# EasyEDA schematic 2020 Light sensor -  Schematic.json
TITLE: 2020 Light Sensor; REV: 1.0; Date: 2019-08-27; Sheet: 1/1; Drawn By: naichen; Company: Your Company
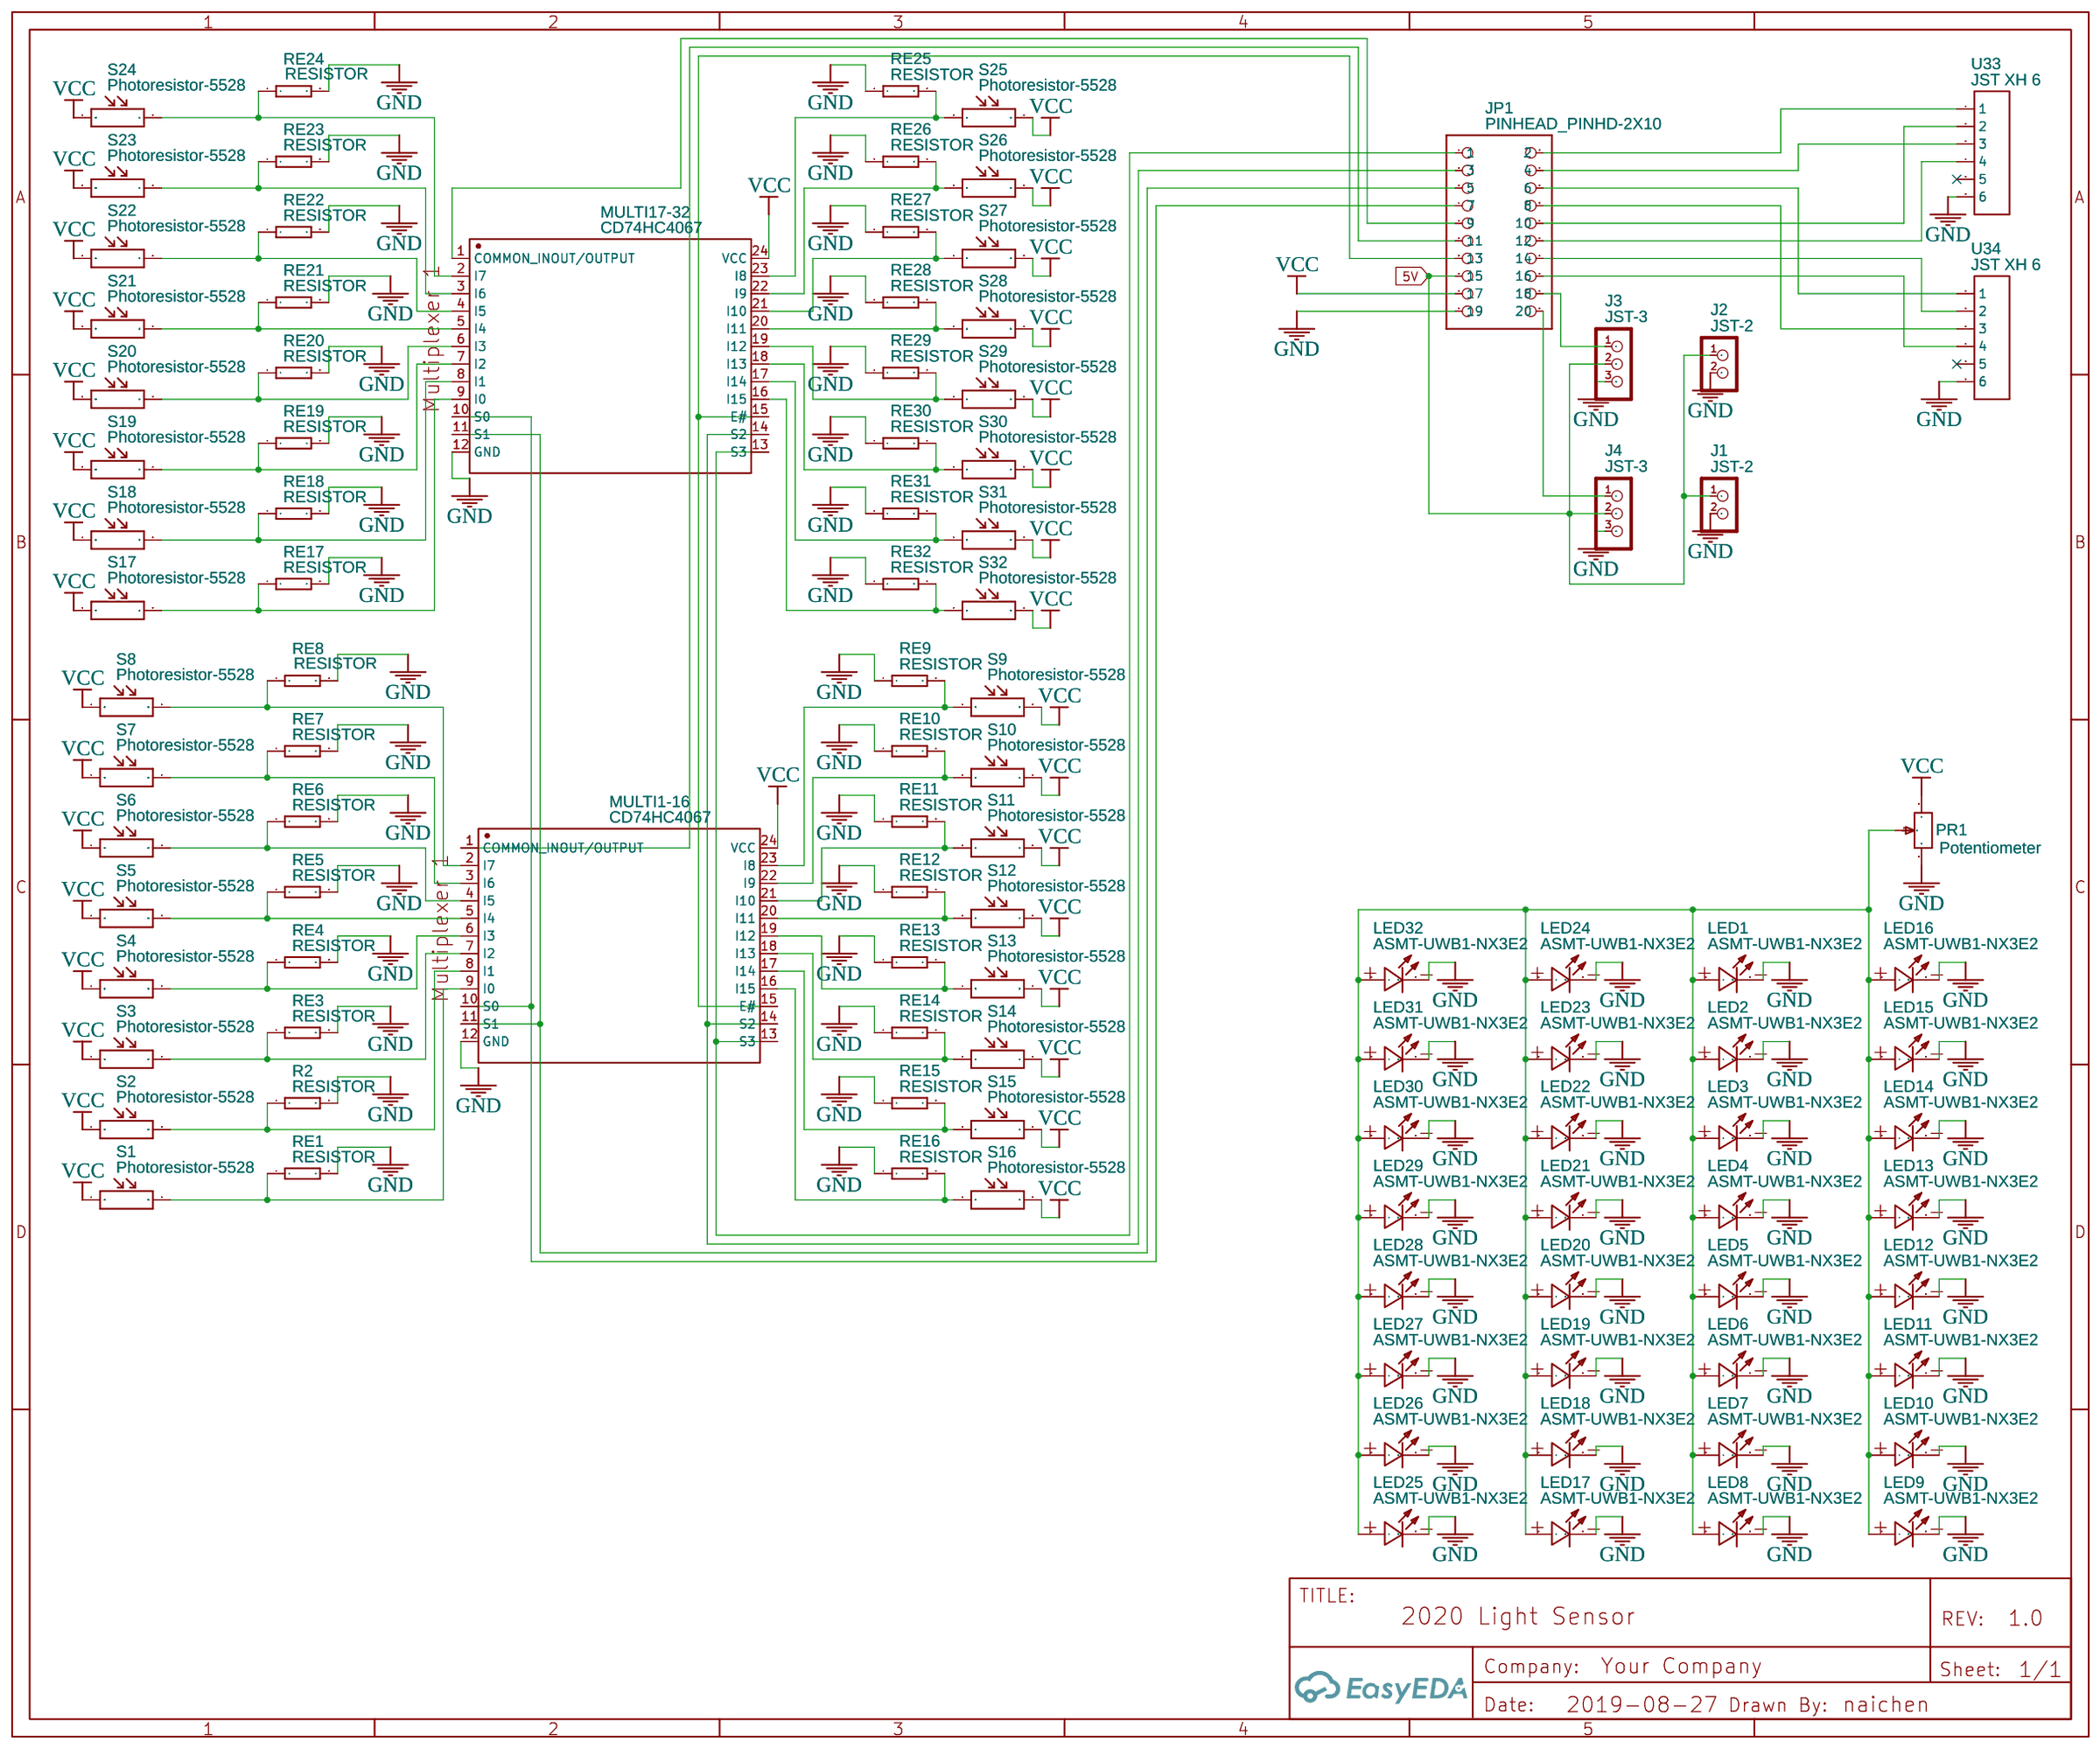
[diagram p0: schematic sheet]

## Parts
J1  JST-2  [JST-2]
J2  JST-2  [JST-2]
J3  JST-3  [JST-3]
J4  JST-3  [JST-3]
JP1  PINHEAD_PINHD-2X10  [PINHEAD_2X10]
LED1  ASMT-UWB1-NX3E2  [ASMT-PAD]
LED2  ASMT-UWB1-NX3E2  [ASMT-PAD]
LED3  ASMT-UWB1-NX3E2  [ASMT-PAD]
LED4  ASMT-UWB1-NX3E2  [ASMT-PAD]
LED5  ASMT-UWB1-NX3E2  [ASMT-PAD]
LED6  ASMT-UWB1-NX3E2  [ASMT-PAD]
LED7  ASMT-UWB1-NX3E2  [ASMT-PAD]
LED8  ASMT-UWB1-NX3E2  [ASMT-PAD]
LED9  ASMT-UWB1-NX3E2  [ASMT-PAD]
LED10  ASMT-UWB1-NX3E2  [ASMT-PAD]
LED11  ASMT-UWB1-NX3E2  [ASMT-PAD]
LED12  ASMT-UWB1-NX3E2  [ASMT-PAD]
LED13  ASMT-UWB1-NX3E2  [ASMT-PAD]
LED14  ASMT-UWB1-NX3E2  [ASMT-PAD]
LED15  ASMT-UWB1-NX3E2  [ASMT-PAD]
LED16  ASMT-UWB1-NX3E2  [ASMT-PAD]
LED17  ASMT-UWB1-NX3E2  [ASMT-PAD]
LED18  ASMT-UWB1-NX3E2  [ASMT-PAD]
LED19  ASMT-UWB1-NX3E2  [ASMT-PAD]
LED20  ASMT-UWB1-NX3E2  [ASMT-PAD]
LED21  ASMT-UWB1-NX3E2  [ASMT-PAD]
LED22  ASMT-UWB1-NX3E2  [ASMT-PAD]
LED23  ASMT-UWB1-NX3E2  [ASMT-PAD]
LED24  ASMT-UWB1-NX3E2  [ASMT-PAD]
LED25  ASMT-UWB1-NX3E2  [ASMT-PAD]
LED26  ASMT-UWB1-NX3E2  [ASMT-PAD]
LED27  ASMT-UWB1-NX3E2  [ASMT-PAD]
LED28  ASMT-UWB1-NX3E2  [ASMT-PAD]
LED29  ASMT-UWB1-NX3E2  [ASMT-PAD]
LED30  ASMT-UWB1-NX3E2  [ASMT-PAD]
LED31  ASMT-UWB1-NX3E2  [ASMT-PAD]
LED32  ASMT-UWB1-NX3E2  [ASMT-PAD]
MULTI1-16  CD74HC4067  [SSOP-24_208MIL]
MULTI17-32  CD74HC4067  [SSOP-24_208MIL]
PR1  Potentiometer  [RES-ADJ_3296W]
R2  RESISTOR  [RTH025W]
RE1  RESISTOR  [RTH025W]
RE3  RESISTOR  [RTH025W]
RE4  RESISTOR  [RTH025W]
RE5  RESISTOR  [RTH025W]
RE6  RESISTOR  [RTH025W]
RE7  RESISTOR  [RTH025W]
RE8  RESISTOR  [RTH025W]
RE9  RESISTOR  [RTH025W]
RE10  RESISTOR  [RTH025W]
RE11  RESISTOR  [RTH025W]
RE12  RESISTOR  [RTH025W]
RE13  RESISTOR  [RTH025W]
RE14  RESISTOR  [RTH025W]
RE15  RESISTOR  [RTH025W]
RE16  RESISTOR  [RTH025W]
RE17  RESISTOR  [RTH025W]
RE18  RESISTOR  [RTH025W]
RE19  RESISTOR  [RTH025W]
RE20  RESISTOR  [RTH025W]
RE21  RESISTOR  [RTH025W]
RE22  RESISTOR  [RTH025W]
RE23  RESISTOR  [RTH025W]
RE24  RESISTOR  [RTH025W]
RE25  RESISTOR  [RTH025W]
RE26  RESISTOR  [RTH025W]
RE27  RESISTOR  [RTH025W]
RE28  RESISTOR  [RTH025W]
RE29  RESISTOR  [RTH025W]
RE30  RESISTOR  [RTH025W]
RE31  RESISTOR  [RTH025W]
RE32  RESISTOR  [RTH025W]
S1  Photoresistor-5528  [SNR2-3.0]
S2  Photoresistor-5528  [SNR2-3.0]
S3  Photoresistor-5528  [SNR2-3.0]
S4  Photoresistor-5528  [SNR2-3.0]
S5  Photoresistor-5528  [SNR2-3.0]
S6  Photoresistor-5528  [SNR2-3.0]
S7  Photoresistor-5528  [SNR2-3.0]
S8  Photoresistor-5528  [SNR2-3.0]
S9  Photoresistor-5528  [SNR2-3.0]
S10  Photoresistor-5528  [SNR2-3.0]
S11  Photoresistor-5528  [SNR2-3.0]
S12  Photoresistor-5528  [SNR2-3.0]
S13  Photoresistor-5528  [SNR2-3.0]
S14  Photoresistor-5528  [SNR2-3.0]
S15  Photoresistor-5528  [SNR2-3.0]
S16  Photoresistor-5528  [SNR2-3.0]
S17  Photoresistor-5528  [SNR2-3.0]
S18  Photoresistor-5528  [SNR2-3.0]
S19  Photoresistor-5528  [SNR2-3.0]
S20  Photoresistor-5528  [SNR2-3.0]
S21  Photoresistor-5528  [SNR2-3.0]
S22  Photoresistor-5528  [SNR2-3.0]
S23  Photoresistor-5528  [SNR2-3.0]
S24  Photoresistor-5528  [SNR2-3.0]
S25  Photoresistor-5528  [SNR2-3.0]
S26  Photoresistor-5528  [SNR2-3.0]
S27  Photoresistor-5528  [SNR2-3.0]
S28  Photoresistor-5528  [SNR2-3.0]
S29  Photoresistor-5528  [SNR2-3.0]
S30  Photoresistor-5528  [SNR2-3.0]
S31  Photoresistor-5528  [SNR2-3.0]
S32  Photoresistor-5528  [SNR2-3.0]
U33  JST XH 6  [JST_XH_6X2.54MM]
U34  JST XH 6  [JST_XH_6X2.54MM]

## Library data of the parts
J1 J2 = JST-2: Contributor: cpu76239
J3 J4 = JST-3: Contributor: cpu76239
JP1 = -: Contributor: Airtau
LED1-LED32 = -: Supplier: LCSC; Supplier Part: C188684; Manufacturer: Broadcom; Manufacturer Part: ASMT-BG20-AS000; Contributor: LCSC
MULTI1-16 MULTI17-32 = -: sourceId: 1T5FDZYC8
PR1 = -: Supplier Part: C21881; Supplier: LCSC; Manufacturer: ReliaPro; Manufacturer Part: Precision potentiometer 3296W/50ohm; image: http://image.lceda.cn/szlcsc/C21881.jpg
R2 RE1 RE3-RE32 = -: Contributor: DangerousPrototype
S1-S32 = -: DIP RES Photoresistor 10K;2P-3.0
U33 U34 = -: Manufacturer Part: JST_XH CONNECTOR; link: https://nl.aliexpress.com/item/50-sets-Kit-in-doos-2-p-3-p-4-pin-2-54mm-Pitch-Terminal-Behuizing/32681086028.html?spm=a2g0s.9042311.0.0.I0g15Z; Contributor: CowboyWillT

## Nets
5V: J1.1 J2.1 J3.2 J4.2 JP1.15
GND: J1.2 J2.2 J3.3 J4.3 JP1.19 LED1.2(C) LED2.2(C) LED3.2(C) LED4.2(C) LED5.2(C) LED6.2(C) LED7.2(C) LED8.2(C) LED9.2(C) LED10.2(C) LED11.2(C) LED12.2(C) LED13.2(C) LED14.2(C) LED15.2(C) LED16.2(C) LED17.2(C) LED18.2(C) LED19.2(C) LED20.2(C) LED21.2(C) LED22.2(C) LED23.2(C) LED24.2(C) LED25.2(C) LED26.2(C) LED27.2(C) LED28.2(C) LED29.2(C) LED30.2(C) LED31.2(C) LED32.2(C) MULTI1-16.12(GND) MULTI17-32.12(GND) PR1.3 R2.2 RE1.2 RE3.2 RE4.2 RE5.2 RE6.2 RE7.2 RE8.2 RE9.1 RE10.1 RE11.1 RE12.1 RE13.1 RE14.1 RE15.1 RE16.1 RE17.2 RE18.2 RE19.2 RE20.2 RE21.2 RE22.2 RE23.2 RE24.2 RE25.1 RE26.1 RE27.1 RE28.1 RE29.1 RE30.1 RE31.1 RE32.1 U33.6 U34.6
VCC: JP1.17 MULTI1-16.24(VCC) MULTI17-32.24(VCC) PR1.1 S1.1(P$1) S2.1(P$1) S3.1(P$1) S4.1(P$1) S5.1(P$1) S6.1(P$1) S7.1(P$1) S8.1(P$1) S9.2(P$2) S10.2(P$2) S11.2(P$2) S12.2(P$2) S13.2(P$2) S14.2(P$2) S15.2(P$2) S16.2(P$2) S17.1(P$1) S18.1(P$1) S19.1(P$1) S20.1(P$1) S21.1(P$1) S22.1(P$1) S23.1(P$1) S24.1(P$1) S25.2(P$2) S26.2(P$2) S27.2(P$2) S28.2(P$2) S29.2(P$2) S30.2(P$2) S31.2(P$2) S32.2(P$2)
Net-(J3-1): J3.1 JP1.18
Net-(J4-1): J4.1 JP1.20
Net-(JP1-1): JP1.1 MULTI1-16.13(S3) MULTI17-32.13(S3)
Net-(JP1-2): JP1.2 U33.1
Net-(JP1-3): JP1.3 MULTI1-16.14(S2) MULTI17-32.14(S2)
Net-(JP1-4): JP1.4 U33.3
Net-(JP1-5): JP1.5 MULTI1-16.11(S1) MULTI17-32.11(S1)
Net-(JP1-6): JP1.6 U34.1
Net-(JP1-7): JP1.7 MULTI1-16.10(S0) MULTI17-32.10(S0)
Net-(JP1-8): JP1.8 U34.3
Net-(JP1-9): JP1.9 MULTI17-32.1(COMMON INOUT/OUTPUT)
Net-(JP1-10): JP1.10 U33.2
Net-(JP1-11): JP1.11 MULTI1-16.1(COMMON INOUT/OUTPUT)
Net-(JP1-12): JP1.12 U33.4
Net-(JP1-13): JP1.13 MULTI1-16.15(E#) MULTI17-32.15(E#)
Net-(JP1-14): JP1.14 U34.2
Net-(JP1-16): JP1.16 U34.4
Net-(LED1-1): LED1.1(A) LED2.1(A) LED3.1(A) LED4.1(A) LED5.1(A) LED6.1(A) LED7.1(A) LED8.1(A) LED9.1(A) LED10.1(A) LED11.1(A) LED12.1(A) LED13.1(A) LED14.1(A) LED15.1(A) LED16.1(A) LED17.1(A) LED18.1(A) LED19.1(A) LED20.1(A) LED21.1(A) LED22.1(A) LED23.1(A) LED24.1(A) LED25.1(A) LED26.1(A) LED27.1(A) LED28.1(A) LED29.1(A) LED30.1(A) LED31.1(A) LED32.1(A) PR1.2
Net-(MULTI1-16-2): MULTI1-16.2(I7) RE8.1 S8.2(P$2)
Net-(MULTI1-16-3): MULTI1-16.3(I6) RE7.1 S7.2(P$2)
Net-(MULTI1-16-4): MULTI1-16.4(I5) RE6.1 S6.2(P$2)
Net-(MULTI1-16-5): MULTI1-16.5(I4) RE5.1 S5.2(P$2)
Net-(MULTI1-16-6): MULTI1-16.6(I3) RE4.1 S4.2(P$2)
Net-(MULTI1-16-7): MULTI1-16.7(I2) RE3.1 S3.2(P$2)
Net-(MULTI1-16-8): MULTI1-16.8(I1) R2.1 S2.2(P$2)
Net-(MULTI1-16-9): MULTI1-16.9(I0) RE1.1 S1.2(P$2)
Net-(MULTI1-16-16): MULTI1-16.16(I15) RE16.2 S16.1(P$1)
Net-(MULTI1-16-17): MULTI1-16.17(I14) RE15.2 S15.1(P$1)
Net-(MULTI1-16-18): MULTI1-16.18(I13) RE14.2 S14.1(P$1)
Net-(MULTI1-16-19): MULTI1-16.19(I12) RE13.2 S13.1(P$1)
Net-(MULTI1-16-20): MULTI1-16.20(I11) RE12.2 S12.1(P$1)
Net-(MULTI1-16-21): MULTI1-16.21(I10) RE11.2 S11.1(P$1)
Net-(MULTI1-16-22): MULTI1-16.22(I9) RE10.2 S10.1(P$1)
Net-(MULTI1-16-23): MULTI1-16.23(I8) RE9.2 S9.1(P$1)
Net-(MULTI17-32-2): MULTI17-32.2(I7) RE24.1 S24.2(P$2)
Net-(MULTI17-32-3): MULTI17-32.3(I6) RE23.1 S23.2(P$2)
Net-(MULTI17-32-4): MULTI17-32.4(I5) RE22.1 S22.2(P$2)
Net-(MULTI17-32-5): MULTI17-32.5(I4) RE21.1 S21.2(P$2)
Net-(MULTI17-32-6): MULTI17-32.6(I3) RE20.1 S20.2(P$2)
Net-(MULTI17-32-7): MULTI17-32.7(I2) RE19.1 S19.2(P$2)
Net-(MULTI17-32-8): MULTI17-32.8(I1) RE18.1 S18.2(P$2)
Net-(MULTI17-32-9): MULTI17-32.9(I0) RE17.1 S17.2(P$2)
Net-(MULTI17-32-16): MULTI17-32.16(I15) RE32.2 S32.1(P$1)
Net-(MULTI17-32-17): MULTI17-32.17(I14) RE31.2 S31.1(P$1)
Net-(MULTI17-32-18): MULTI17-32.18(I13) RE30.2 S30.1(P$1)
Net-(MULTI17-32-19): MULTI17-32.19(I12) RE29.2 S29.1(P$1)
Net-(MULTI17-32-20): MULTI17-32.20(I11) RE28.2 S28.1(P$1)
Net-(MULTI17-32-21): MULTI17-32.21(I10) RE27.2 S27.1(P$1)
Net-(MULTI17-32-22): MULTI17-32.22(I9) RE26.2 S26.1(P$1)
Net-(MULTI17-32-23): MULTI17-32.23(I8) RE25.2 S25.1(P$1)

Not connected (* = marked no-connect by the designer): U33 5*; U34 5*
